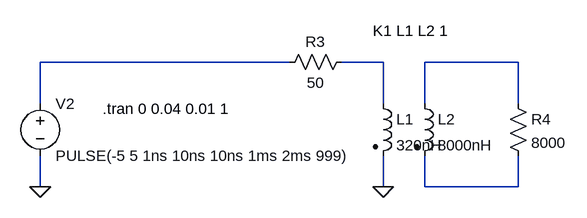
[diagram p0: schematic Circuit Theory Lab-2.asc]
Circuit Theory Lab-2.asc, the LTspice schematic file:
Version 4
SHEET 1 1352 680
WIRE 576 80 192 80
WIRE 720 80 656 80
WIRE 928 80 784 80
WIRE 192 144 192 80
WIRE 720 144 720 80
WIRE 784 144 784 80
WIRE 928 144 928 80
WIRE 192 272 192 224
WIRE 720 272 720 224
WIRE 784 272 784 224
WIRE 928 272 928 224
WIRE 928 272 784 272
FLAG 720 272 0
FLAG 192 272 0
SYMBOL res 672 64 R90
WINDOW 0 0 56 VBottom 2
WINDOW 3 32 56 VTop 2
SYMATTR InstName R3
SYMATTR Value 50
SYMBOL ind2 704 128 R0
SYMATTR InstName L1
SYMATTR Value 320nH
SYMATTR Type ind
SYMBOL ind2 768 128 R0
SYMATTR InstName L2
SYMATTR Value 8000nH
SYMATTR Type ind
SYMBOL res 912 128 R0
SYMATTR InstName R4
SYMATTR Value 8000
SYMBOL voltage 192 128 R0
WINDOW 123 0 0 Left 0
WINDOW 39 0 0 Left 0
SYMATTR InstName V2
SYMATTR Value PULSE(-5 5 1ns 10ns 10ns 1ms 2ms 999)
TEXT 704 32 Left 2 !K1 L1 L2 1
TEXT 288 152 Left 2 !.tran 0 0.04 0.01 1

The netlist it stands for:
* Circuit Theory Lab-2.asc
R3 N002 N001 50
L1 N002 0 320nH
L2 N003 N004 8000nH
R4 N003 N004 8000
V2 N001 0 PULSE(-5 5 1ns 10ns 10ns 1ms 2ms 999)
K1 L1 L2 1
.tran 0 0.04 0.01 1
.backanno
.end